# EAGLE schematic SMC_FrontPanel_ExtensionBoard_V14_5 (EAGLE 9.6.2)
SIZE: 0.04

## Sheet 1 of 2
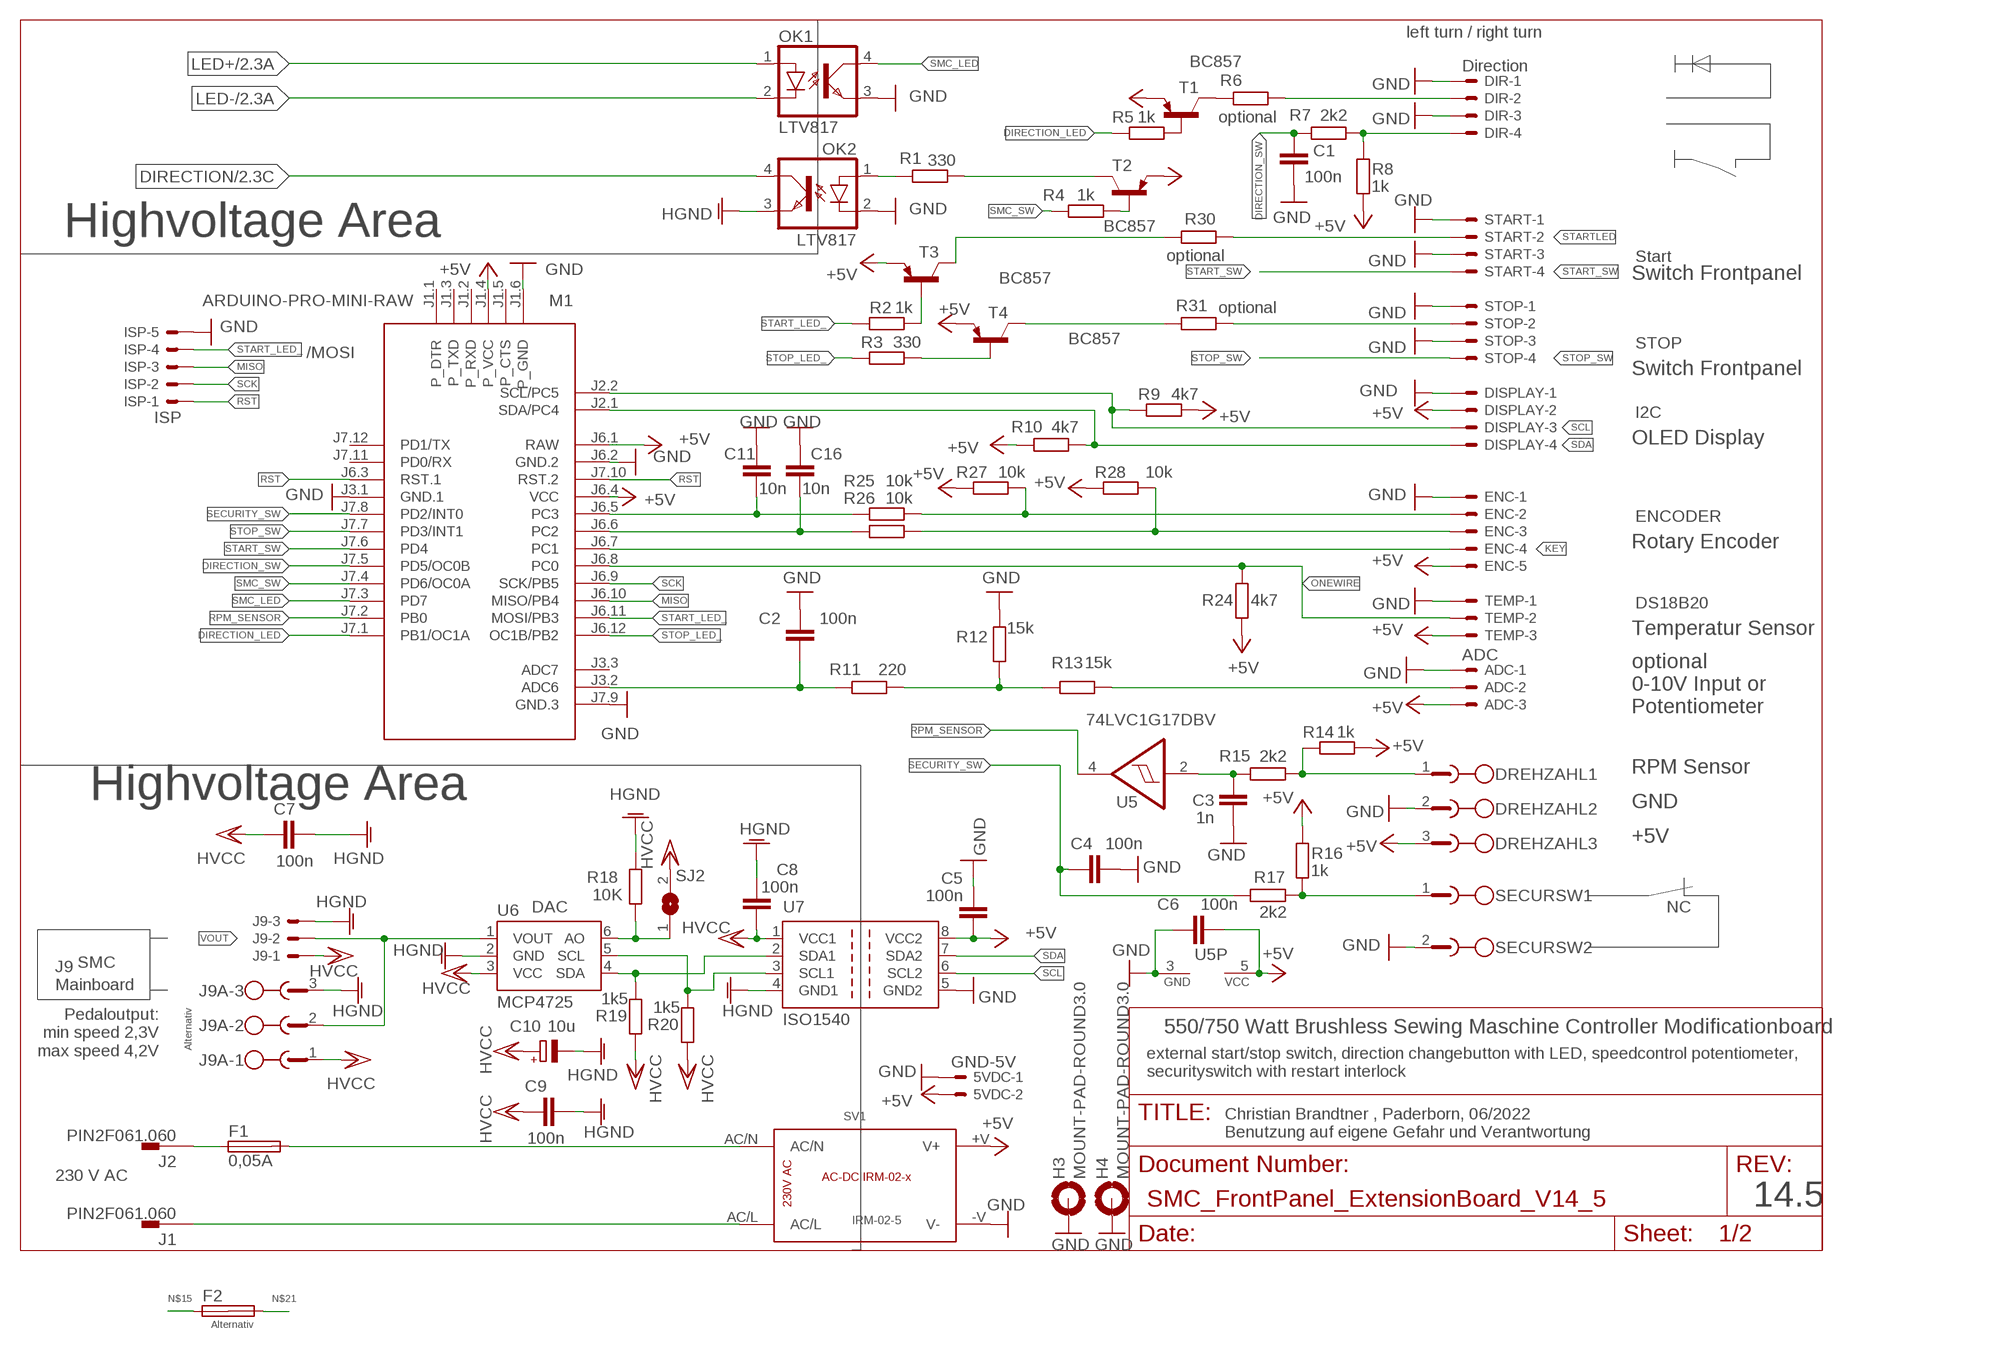
[diagram p0: schematic, sheet 1]

### Parts
5VDC  GND-5V  JST-XH-02-PIN-ROUND-PAD  [JST-XH-02-PACKAGE-ROUND-PAD]
ADC  ADC  JST-XH-03-PIN-ROUND-PAD  [JST-XH-03-PACKAGE-ROUND-PAD]
C1  100n  C-EUC0805  [C0805]
C2  100n  C-EUC0805  [C0805]
C3  1n  C-EUC0805  [C0805]
C4  100n  C-EUC0805  [C0805]
C5  100n  C-EUC0805  [C0805]
C6  100n  C-EUC0805  [C0805]
C7  100n  C-EUC0805  [C0805]
C8  100n  C-EUC0805  [C0805]
C9  100n  C-EUC0805  [C0805]
C10  10u  CPOL-EU153CLV-0405  [153CLV-0405]
C11  10n  C-EUC0805  [C0805]
C16  10n  C-EUC0805  [C0805]
DIR  Direction  JST-XH-04-PIN-ROUND-PAD  [JST-XH-04-PACKAGE-ROUND-PAD]
DISPLAY  I2C  JST-XH-04-PIN-ROUND-PAD  [JST-XH-04-PACKAGE-ROUND-PAD]
DREHZAHL  MCV_1.5/3/-G-3.5  [1843619]
ENC  ENCODER  JST-XH-05-PIN-ROUND-PAD  [JST-XH-05-PACKAGE-ROUND-PAD]
F1  0,05A  FUSE  [MTA501100]
F2  SHK20L  [SHK20L]
H3  MOUNT-PAD-ROUND3.0  [3,0-PAD]
H4  MOUNT-PAD-ROUND3.0  [3,0-PAD]
ISP  ISP  JST-XH-05-PIN-ROUND-PAD  [JST-XH-05-PACKAGE-ROUND-PAD]
J1  PIN2F061.060  [F061.060]
J2  PIN2F061.060  [F061.060]
J9  JST-XH-03-PIN-ROUND-PAD  [JST-XH-03-PACKAGE-ROUND-PAD]
J9A-  MCV_1.5/3/-G-3.5  [1843619]
M1  ARDUINO-PRO-MINI-RAW  [ARDUINO-PRO-MINI]
OK1  LTV817  SFH6186-2  [SMD4-7]
OK2  LTV817  SFH6186-2  [SMD4-7]
R1  330  R-EU_R0805  [R0805]
R2  1k  R-EU_R0805  [R0805]
R3  330  R-EU_R0805  [R0805]
R4  1k  R-EU_R0805  [R0805]
R5  1k  R-EU_R0805  [R0805]
R6  optional  R-EU_R0805  [R0805]
R7  2k2  R-EU_R0805  [R0805]
R8  1k  R-EU_R0805  [R0805]
R9  4k7  R-EU_R0805  [R0805]
R10  4k7  R-EU_R0805  [R0805]
R11  220  R-EU_R0805  [R0805]
R12  15k  R-EU_R0805  [R0805]
R13  15k  R-EU_R0805  [R0805]
R14  1k  R-EU_R0805  [R0805]
R15  2k2  R-EU_R0805  [R0805]
R16  1k  R-EU_R0805  [R0805]
R17  2k2  R-EU_R0805  [R0805]
R18  10K  R-EU_R0805  [R0805]
R19  1k5  R-EU_R0805  [R0805]
R20  1k5  R-EU_R0805  [R0805]
R24  4k7  R-EU_R0805  [R0805]
R25  10k  R-EU_R0805  [R0805]
R26  10k  R-EU_R0805  [R0805]
R27  10k  R-EU_R0805  [R0805]
R28  10k  R-EU_R0805  [R0805]
R30  optional  R-EU_R0805  [R0805]
R31  optional  R-EU_R0805  [R0805]
SECURSW  MCV_1,5/2-G-3,5  [1843606]
SJ2  SJ  [SJ]
START  Start  JST-XH-04-PIN-ROUND-PAD  [JST-XH-04-PACKAGE-ROUND-PAD]
STOP  STOP  JST-XH-04-PIN-ROUND-PAD  [JST-XH-04-PACKAGE-ROUND-PAD]
SV1  IRM-02-5  IRM-02-X  [IRM-02-X]
T1  BC857  BC857ASMD  [SOT23-BEC]
T2  BC857  BC857ASMD  [SOT23-BEC]
T3  BC857  BC857ASMD  [SOT23-BEC]
T4  BC857  BC857ASMD  [SOT23-BEC]
TEMP  DS18B20  JST-XH-03-PIN-ROUND-PAD  [JST-XH-03-PACKAGE-ROUND-PAD]
U5  74LVC1G17DBV  [SOT23-5]
U6  MCP4725  MCP4725SOT-23  [SOT23-6]
U7  ISO1540  [SO-08]

### Nets
+5V: 5VDC.2 ADC.3 C5.1 C6.1 DISPLAY.2 DREHZAHL.3 ENC.5 M1.J1.4(P_VCC) M1.J6.1(RAW) M1.J6.4(VCC) R8.2 R9.1 R10.1 R14.1 R16.1 R24.2 R27.1 R28.1 SV1.+V(V+) T1.E T2.E T3.E T4.E TEMP.3 U5.5(VCC) U7.8(VCC2)
ADC_POTI: C2.1 M1.J3.2(ADC6) R11.1
DIRECTION: OK2.4(COL) ; also sheet 2
DIRECTION_LED: M1.J7.1(PB1/OC1A) R5.2
DIRECTION_SW: C1.2 M1.J7.5(PD5/OC0B) R7.1
GND: 5VDC.1 ADC.1 C1.1 C2.2 C3.1 C4.2 C5.2 C6.2 C11.2 C16.2 DIR.1 DIR.3 DISPLAY.1 DREHZAHL.2 ENC.1 H3.B3,0(MOUNT) H4.B3,0(MOUNT) ISP.5 M1.J1.6(P_GND) M1.J3.1(GND.1) M1.J6.2(GND.2) M1.J7.9(GND.3) OK1.3(EMIT) OK2.2(C) R12.2 SECURSW.2 START.1 START.3 STOP.1 STOP.3 SV1.-V(V-) TEMP.1 U5.3(GND) U7.5(GND2)
HGND: C7.1 C8.2 C9.1 C10.- J9.3 J9A-.3 OK2.3(EMIT) R18.1 U6.2(GND) U7.4(GND1) ; also sheet 2
HVCC: C7.2 C8.1 C9.2 C10.+ J9.1 J9A-.1 R19.2 R20.2 SJ2.2 U6.3(VCC) U7.1(VCC1) ; also sheet 2
KEY: ENC.4 M1.J6.7(PC1)
LED+: OK1.1(A) ; also sheet 2
LED-: OK1.2(C) ; also sheet 2
MISO: ISP.3 M1.J6.10(MISO/PB4)
N$2: OK2.1(A) R1.2
N$5: R1.1 T2.C
N$6: R30.1 START.2
N$7: R2.1 T3.B
N$8: C3.2 R15.1 U5.2(I)
N$11: R3.1 T4.B
N$14: R18.2 SJ2.1 U6.6(AO)
N$15: F1.1 F2.1A J2.A1 J2.A2
N$16: DREHZAHL.1 R14.2 R15.2
N$17: R16.2 R17.2 SECURSW.1
N$18: R31.2 T4.C
N$19: R11.2 R12.1 R13.2
N$20: ADC.2 R13.1
N$21: F1.2 F2.2A SV1.AC/N
N$22: J1.A1 J1.A2 SV1.AC/L
N$23: R6.2 T1.C
N$24: DIR.2 R6.1
N$25: R5.1 T1.B
N$26: R4.1 T2.B
N$28: R20.1 U6.5(SCL) U7.3(SCL1)
N$29: DIR.4 R7.2 R8.1
N$30: C16.1 M1.J6.6(PC2) R26.1
N$31: C11.1 M1.J6.5(PC3) R25.1
N$32: ENC.2 R25.2 R27.2
N$33: ENC.3 R26.2 R28.2
N$34: R31.1 STOP.2
ONEWIRE: M1.J6.8(PC0) R24.1 TEMP.2
RPM_SENSOR: M1.J7.2(PB0) U5.4(O)
RST: ISP.1 M1.J6.3(RST.1) M1.J7.10(RST.2)
SCK: ISP.2 M1.J6.9(SCK/PB5)
SCL: DISPLAY.3 M1.J2.2(SCL/PC5) R9.2 U7.6(SCL2)
SDA: DISPLAY.4 M1.J2.1(SDA/PC4) R10.2 U7.7(SDA2)
SDA_HV: R19.1 U6.4(SDA) U7.2(SDA1)
SECURITY_SW: C4.1 M1.J7.8(PD2/INT0) R17.1
SMC_LED: M1.J7.3(PD7) OK1.4(COL)
SMC_SW: M1.J7.4(PD6/OC0A) R4.2
START_LED_: ISP.4 M1.J6.11(MOSI/PB3) R2.2
START_SW: M1.J7.6(PD4) START.4
STARTLED: R30.2 T3.C
STOP_LED_: M1.J6.12(OC1B/PB2) R3.2
STOP_SW: M1.J7.7(PD3/INT1) STOP.4
VOUT: J9.2 J9A-.2 U6.1(VOUT)
Unconnected: F2.1B F2.2B M1.J1.1(P_DTR) M1.J1.2(P_RXD) M1.J1.3(P_TXD) M1.J1.5(P_CTS) M1.J3.3(ADC7) M1.J7.11(PD0/RX) M1.J7.12(PD1/TX)

### Notes on the sheet
- left turn / right turn
- Highvoltage Area
- Switch Frontpanel
- /MOSI
- Switch Frontpanel
- OLED Display
- Rotary Encoder
- Temperatur Sensor
- optional
  0-10V Input or
  Potentiometer
- RPM Sensor
- Highvoltage Area
- GND
- +5V
- DAC | NC
- SMC
- J9
  Mainboard
- Pedaloutput:
  min speed 2,3V
  max speed 4,2V
- Alternativ
- 550/750 Watt Brushless Sewing Maschine Controller Modificationboard
- external start/stop switch, direction changebutton with LED, speedcontrol potentiometer,
  securityswitch with restart interlock
- Christian Brandtner , Paderborn, 06/2022
  Benutzung auf eigene Gefahr und Verantwortung
- 230 V AC
- 14.5
- Alternativ

## Sheet 2 of 2
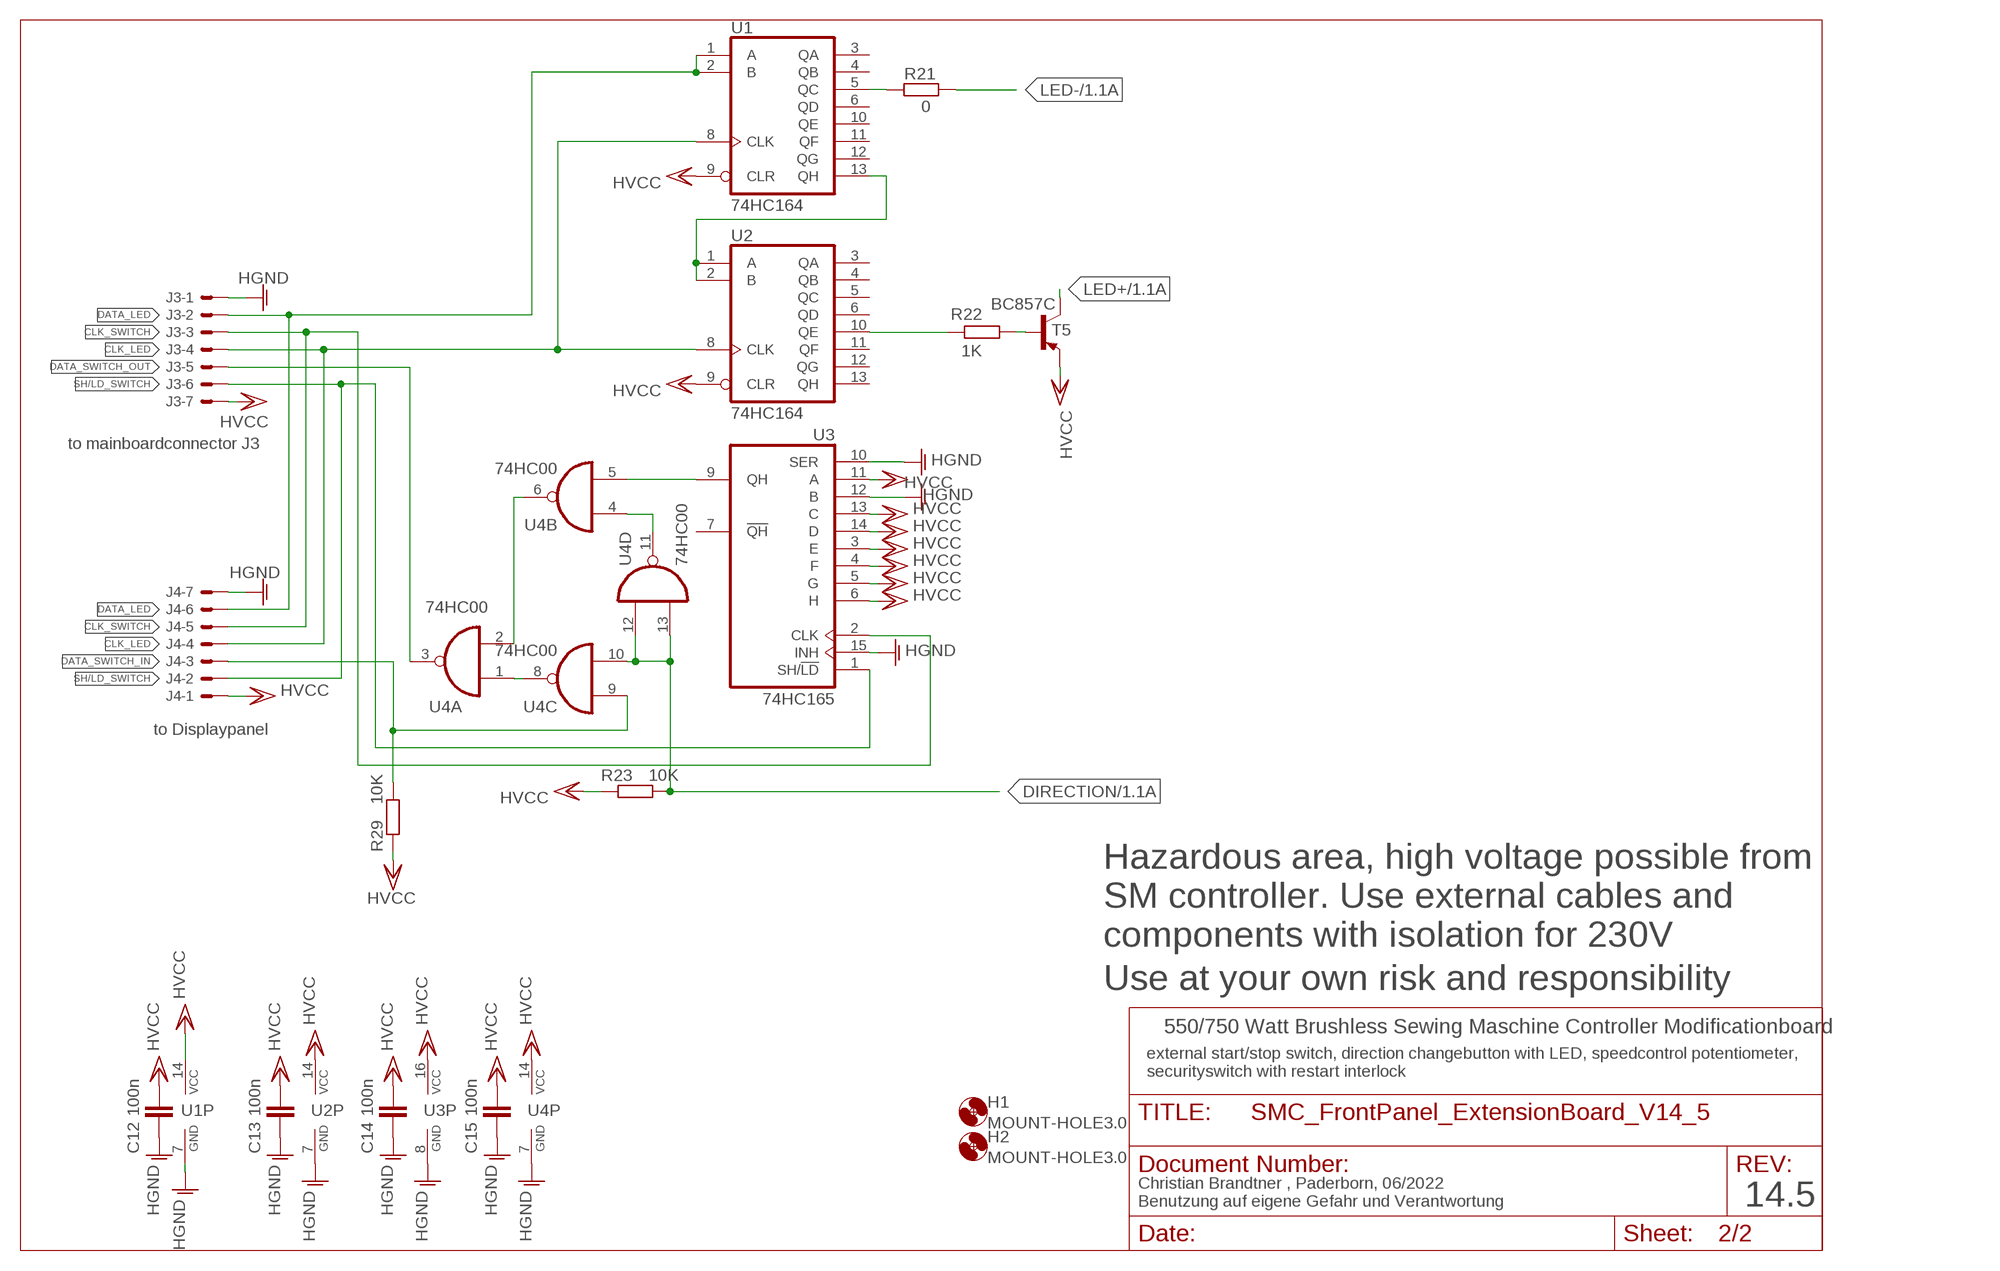
[diagram p1: schematic, sheet 2]

### Parts
C12  100n  C-EUC0805  [C0805]
C13  100n  C-EUC0805  [C0805]
C14  100n  C-EUC0805  [C0805]
C15  100n  C-EUC0805  [C0805]
H1  MOUNT-HOLE3.0  [3,0]
H2  MOUNT-HOLE3.0  [3,0]
J3  to mainboardconnector J3  JST-XH-07-PIN-ROUND-PAD  [JST-XH-07-PACKAGE-ROUND-PAD]
J4  to Displaypanel  JST-XH-07-PIN-ROUND-PAD  [JST-XH-07-PACKAGE-ROUND-PAD]
R21  0  R-EU_R0805  [R0805]
R22  1K  R-EU_R0805  [R0805]
R23  10K  R-EU_R0805  [R0805]
R29  10K  R-EU_R0805  [R0805]
T5  BC857C  BC857C-PNP-SOT23-BEC  [SOT23-BEC]
U1  74HC164  74HC164D  [SO14]
U2  74HC164  74HC164D  [SO14]
U3  74HC165  74HC165D  [SO16]
U4  74HC00  74HC00D  [SO14]

### Nets
CLK_LED: J3.4 J4.4 U1.8(CLK) U2.8(CLK)
CLK_SWITCH: J3.3 J4.5 U3.2(CLK)
DATA_LED: J3.2 J4.6 U1.1(A) U1.2(B)
DATA_SWITCH_IN: J4.3 R29.1 U4.9(C:I0)
DATA_SWITCH_OUT: J3.5 U4.3(A:O)
DIRECTION: R23.1 U4.10(C:I1) U4.12(D:I0) U4.13(D:I1) ; also sheet 1
G: U1.13(QH) U2.1(A) U2.2(B)
HGND: C12.1 C13.1 C14.1 C15.1 J3.1 J4.7 U1.7(GND) U2.7(GND) U3.8(GND) U3.10(SER) U3.12(B) U3.15(INH) U4.7(P:GND) ; also sheet 1
HVCC: C12.2 C13.2 C14.2 C15.2 J3.7 J4.1 R23.2 R29.2 T5.E U1.9(CLR) U1.14(VCC) U2.9(CLR) U2.14(VCC) U3.3(E) U3.4(F) U3.5(G) U3.6(H) U3.11(A) U3.13(C) U3.14(D) U3.16(VCC) U4.14(P:VCC) ; also sheet 1
LED+: T5.C ; also sheet 1
LED-: R21.2 ; also sheet 1
N$1: R22.1 T5.B
N$3: R21.1 U1.5(QC)
N$9: U3.9(QH) U4.5(B:I1)
N$10: U4.2(A:I1) U4.6(B:O)
N$12: U4.1(A:I0) U4.8(C:O)
N$13: U4.4(B:I0) U4.11(D:O)
N$27: R22.2 U2.10(QE)
SH/LD_SWITCH: J3.6 J4.2 U3.1(SH/!LD)
Unconnected: U1.3(QA) U1.4(QB) U1.6(QD) U1.10(QE) U1.11(QF) U1.12(QG) U2.3(QA) U2.4(QB) U2.5(QC) U2.6(QD) U2.11(QF) U2.12(QG) U2.13(QH) U3.7(!QH)

### Notes on the sheet
- Hazardous area, high voltage possible from
  SM controller. Use external cables and
  components with isolation for 230V
- Use at your own risk and responsibility
- 550/750 Watt Brushless Sewing Maschine Controller Modificationboard
- external start/stop switch, direction changebutton with LED, speedcontrol potentiometer,
  securityswitch with restart interlock
- Christian Brandtner , Paderborn, 06/2022
  Benutzung auf eigene Gefahr und Verantwortung
- 14.5

## Library data of the parts
5VDC = Rembrandt Electronics - JST XH Connectors v1-0:JST-XH-02-PIN: JST XH Connector 2 Pin Wire to board connector. Pitch: 2,54 mm, (0.100") Number of pins: 2 Created by Rembrandt Electronics www.rembrandtelectronics.com
ADC J9 TEMP = Rembrandt Electronics - JST XH Connectors v1-0:JST-XH-03-PIN: JST XH Connector 2 Pin Wire to board connector. Pitch: 2,54 mm, (0.100") Number of pins: 3 Created by Rembrandt Electronics www.rembrandtelectronics.com
C1-C9 C11-C16 = rcl:C-EU: CAPACITOR, European symbol; SPICEPREFIX: C
C10 = rcl:CPOL-EU: POLARIZED CAPACITOR, European symbol; SPICEPREFIX: C
DIR DISPLAY START STOP = Rembrandt Electronics - JST XH Connectors v1-0:JST-XH-04-PIN: JST XH Connector 2 Pin Wire to board connector. Pitch: 2,54 mm, (0.100") Number of pins: 4 Created by Rembrandt Electronics www.rembrandtelectronics.com
DREHZAHL J9A- = con-phoenix-350_CB:MCV_1.5/3/-G-3.5
ENC ISP = Rembrandt Electronics - JST XH Connectors v1-0:JST-XH-05-PIN: JST XH Connector 2 Pin Wire to board connector. Pitch: 2,54 mm, (0.100") Number of pins: 5 Created by Rembrandt Electronics www.rembrandtelectronics.com
F1 = fuse_CB:FUSE: Fuse
F2 = fuse:SHK20L: FUSE HOLDER 5 x 20 mm, SH contact, SHH1 Schukat, E1073 Buerklin; OC_FARNELL: unknown; OC_NEWARK: unknown
H1 H2 = holes:MOUNT-HOLE: MOUNTING HOLE with drill center marker
H3 H4 = holes:MOUNT-PAD-ROUND: MOUNTING PAD, round
J1 J2 = con-faston_CB:PIN2: Flachstecker Typ Tyco/Electronics/AMP TAB, FASTON Printed Circuit Board Tabs Source: http://www.buerklin.com, http://catalog.tycoelectronics.com; OC_FARNELL: unknown; OC_NEWARK: unknown
J3 J4 = Rembrandt Electronics - JST XH Connectors v1-0:JST-XH-07-PIN: JST XH Connector 2 Pin Wire to board connector. Pitch: 2,54 mm, (0.100") Number of pins: 7 Created by Rembrandt Electronics www.rembrandtelectronics.com
M1 = diy-modules:ARDUINO-PRO-MINI-RAW
OK1 OK2 = optocoupler:SFH618?*: Optocoupler, Phototransistor Output, Low Input Current Source: Data sheet <http://www.vishay.com/docs/83673/sfh618.pdf>; MF: VISHAY/TELEFUNKEN; MPN: SFH6186-2; OC_FARNELL: 1469583; OC_NEWARK: 58K2210
R1-R31 = resistor:R-EU_: RESISTOR, European symbol
SECURSW = con-phoenix-350_CB:MCV_1,5/2-G-3,5
SJ2 = jumper:SJ: SMD solder JUMPER
SV1 = dc-dc-converter:IRM-02-X: Murata AC-DC Converter 230V AC to xV DC
T1-T4 = transistor-pnp:BC857*: PNP Transistror
T5 = transistor:*-PNP-: PNP Transistror
U1 U2 = 74xx-eu:74*164: 8-bit parallel out SHIFT REGISTER
U3 = 74xx-eu:74*165: 8-bit parallel load SHIFT REGISTER
U4 = 74xx-eu:74*00: Quad 2-input NAND gate
U5 = 74xx-little-de:74*1G17: Single Schmitt-Trigger Buffer
U6 = SparkFun-IC-Conversion:MCP4725: MCP4725 DAC Microchip 12-bit I2C DAC, SOT23-6 Datasheet <https://cdn.sparkfun.com/datasheets/BreakoutBoards/MCP4725_2009.pdf> SparkFun Products SparkFun I2C DAC Breakout - MCP4725 <https://www.sparkfun.com/products/12918> (BOB-12918); PROD_ID: IC-08886
U7 = texas_CB:ISO1540